# EAGLE design adc12-st (EAGLE 7.2.0)
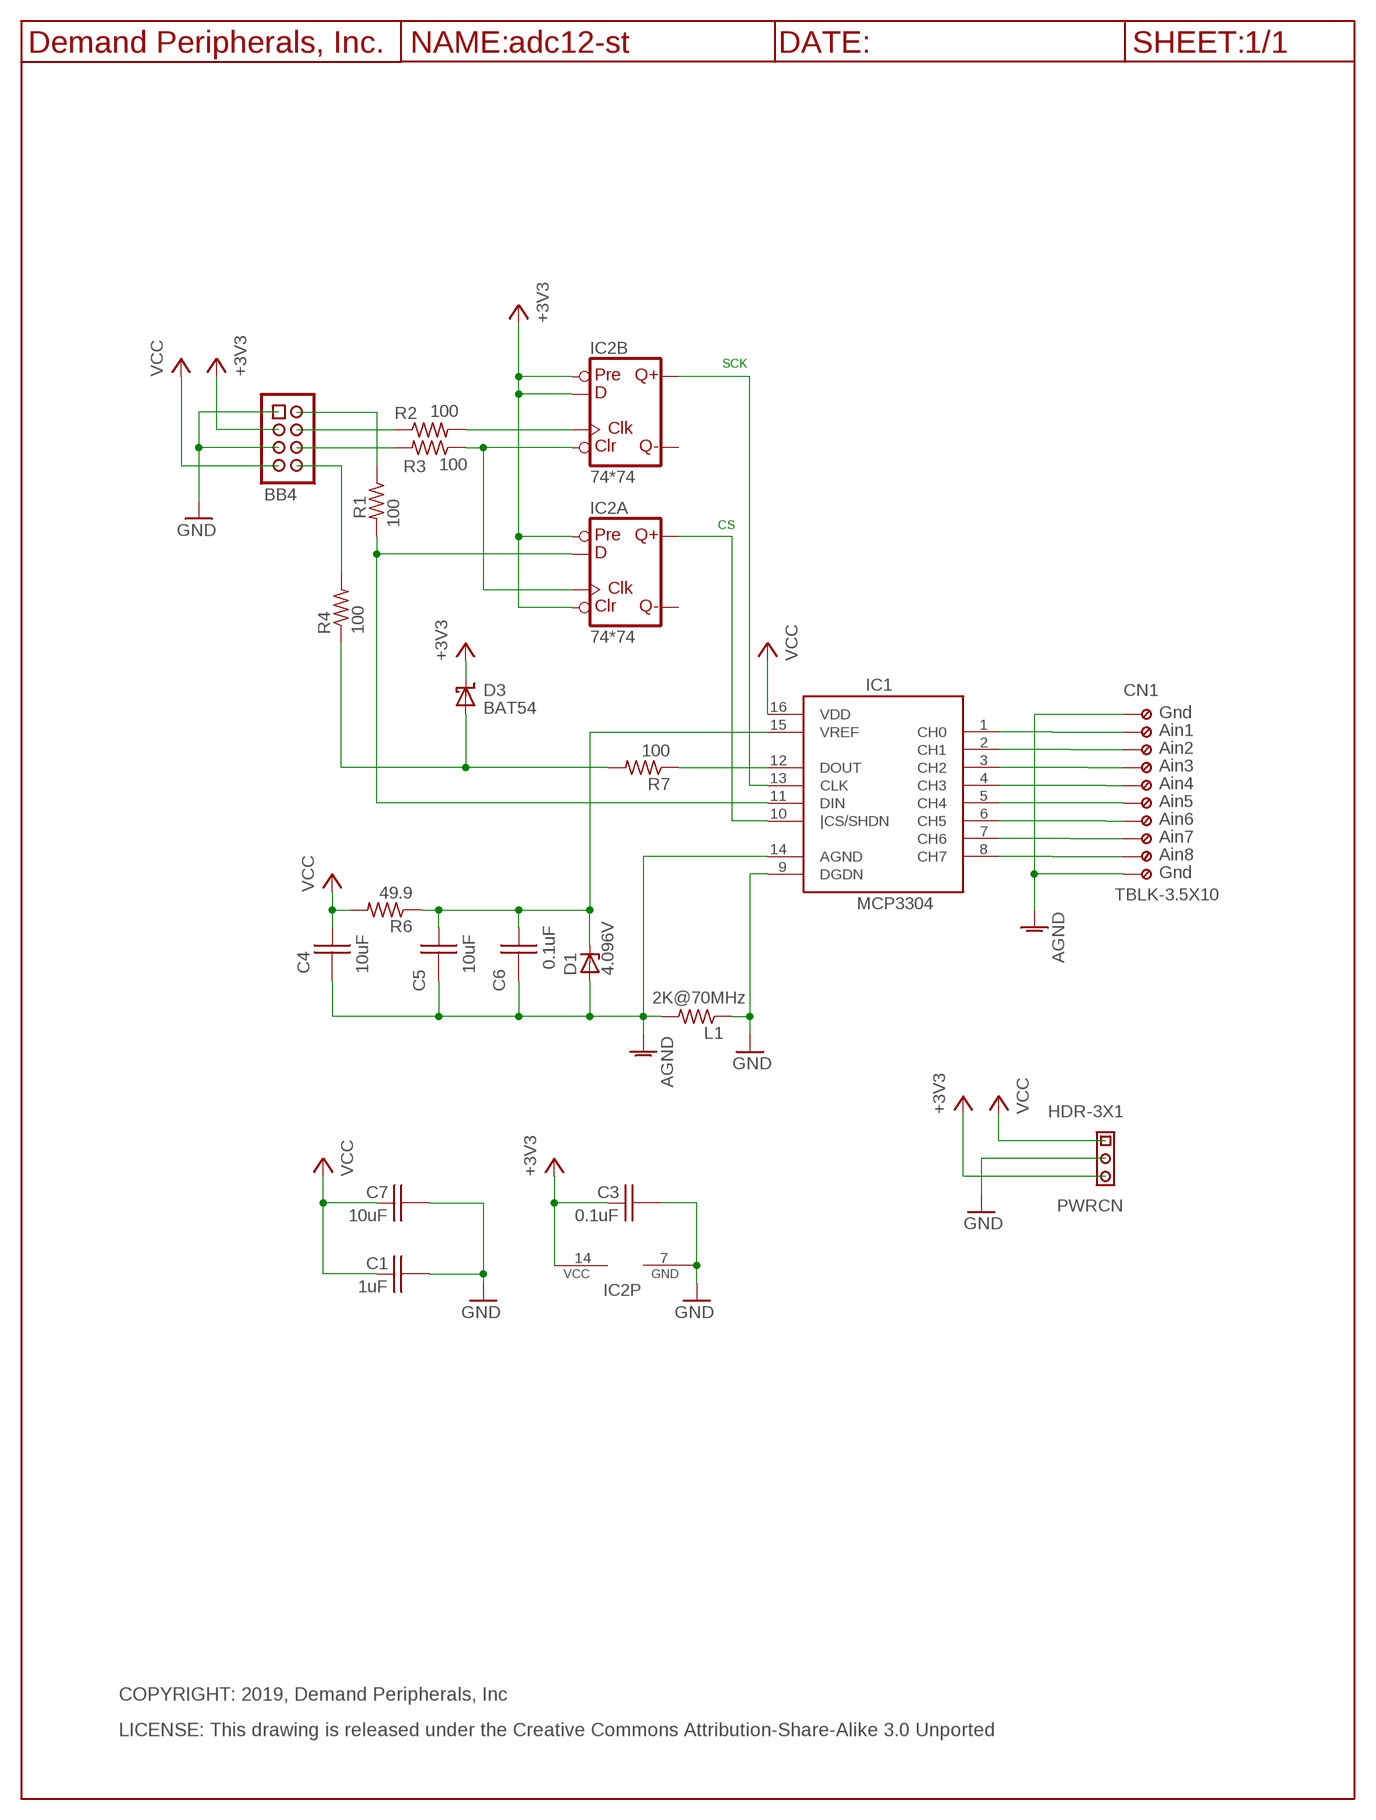
[diagram p0: schematic, sheet 1]

## Parts
BB4  BB4_CON  HDR-4X2-SHR  [HDR-4X2]
C1  1uF  C1.0UF_C0603  [C0603]
C3  0.1uF  C0.1UF_C0603  [C0603]
C4  10uF  C10UF35V_C0805  [C0805]
C5  10uF  C10UF35V_C0805  [C0805]
C6  0.1uF  C0.1UF_C0603  [C0603]
C7  10uF  C10UF35V_C0805  [C0805]
CN1  TBLK-3.5X10  [TBLK-3.5X10]
D1  4.096V  LM4040  [SOT23]
D3  BAT54  [SOT23]
IC1  MCP3304  [SO16]
IC2  74*74  74AHC74SS  [SO14]
L1  2K@70MHz  L2K70MHZR0805  [R0805]
PWRCN  HDR-3X1  [HDR-3X1]
R1  100  R100_R0603  [R0603]
R2  100  R100_R0603  [R0603]
R3  100  R100_R0603  [R0603]
R4  100  R100_R0603  [R0603]
R6  49.9  R49.9R0603  [R0603]
R7  100  R100_R0603  [R0603]
U$3  DP_FRAME_P  [LETTER_P]

## Nets
+3V3: BB4.3 C3.1 D3.3(CC) IC2.1(A:CLR) IC2.4(A:PRE) IC2.10(B:PRE) IC2.12(B:D) IC2.14(P:VCC) PWRCN.3
AGND: C4.2 C5.2 C6.2 CN1.1(KL) CN1.10(KL9) D1.2(A) IC1.14(AGND) L1.2
GND: BB4.1 BB4.5 C1.2 C3.2 C7.2 IC1.9(DGDN) IC2.7(P:GND) L1.1 PWRCN.2
N$1: CN1.2(KL1) IC1.1(CH0)
N$2: CN1.3(KL2) IC1.2(CH1)
N$3: CN1.4(KL3) IC1.3(CH2)
N$4: CN1.5(KL4) IC1.4(CH3)
N$5: CN1.6(KL5) IC1.5(CH4)
N$6: CN1.7(KL6) IC1.6(CH5)
N$7: CN1.8(KL7) IC1.7(CH6)
N$8: CN1.9(KL8) IC1.8(CH7)
N$9: IC1.12(DOUT) R7.1
N$11: D3.1(A) R4.1 R7.2
N$13: IC2.3(A:CLK) IC2.13(B:CLR) R3.1
N$14: BB4.4 R2.1
N$15: IC1.11(DIN) IC2.2(A:D) R1.2
N$16: IC2.11(B:CLK) R2.2
N$17: IC1.10(|CS/SHDN) IC2.5(A:Q)
N$18: IC1.13(CLK) IC2.9(B:Q)
N$19: BB4.6 R3.2
N$20: BB4.2 R1.1
N$21: BB4.8 R4.2
N$23: C5.1 C6.1 D1.1(C) IC1.15(VREF) R6.1
VCC: BB4.7 C1.1 C4.1 C7.1 IC1.16(VDD) PWRCN.1 R6.2
Unconnected: IC2.6(A:!Q) IC2.8(B:!Q)

## Notes on the sheet
- SCK
- CS
- Gnd
- Ain1
- Ain2
- Ain3
- Ain4
- Ain5
- Ain6
- Ain7
- Ain8
- Gnd
- COPYRIGHT: 2019, Demand Peripherals, Inc
- LICENSE: This drawing is released under the Creative Commons Attribution-Share-Alike 3.0 Unported

## Library data of the parts
BB4 = dpi-conn:HDR-4X2-SHR: Shrouded 4x2 pin header; VENDOR: Digikey; VENDOR-PART-NUM: 609-3530-ND
C1 = dpi-passive:C1.0UF_: 1.0 uF Capacitor, 25V, Y5V; VENDOR: Digikey; VENDOR-PART-NUM: 490-3897-2-ND
C3 C6 = dpi-passive:C0.1UF_: 0.1 uF Capacitor, 25V, X7R; VENDOR: Digikey; VENDOR-PART-NUM: 1276-1126-2-ND
C4 C5 C7 = dpi-passive:C10UF35V_: 10 uF Capacitor, 35V, X6S; VENDOR: Digikey; VENDOR-PART-NUM: 490-10504-2-ND
CN1 = dpi-conn:TBLK-3.5X10: Terminal Block, 3.5mm, x10, screw terminals; VENDOR: Digikey; VENDOR-PART-NUM: ED2735-ND
D1 = dpi-diopto:LM4040: Zener Diode, 4.096 volts, +/-0.2%; VENDOR: Digikey; VENDOR-PART-NUM: LM4040BIM3-4.1/NOPBCT-ND
D3 = dpi-diopto:BAT54: Schottky Diode; VENDOR: Digikey; VENDOR-PART-NUM: DB3Y313KELCT-ND
IC1 = dpi-transic:MCP3304: 8 channel ADC converter with SPI interface; VENDOR: Digikey; VENDOR-PART-NUM: MCP3304-CI/SL-ND
IC2 = dpi-transic:74AHC74: Dual D type positive edge triggered FLIP FLOP, preset and clear; VENDOR: Digikey; VENDOR-PART-NUM: 568-4458-1-ND
L1 = dpi-passive:L2K70MHZ: Ferrite filter, 2K Ohm at 70MHz; VENDOR: Digikey; VENDOR-PART-NUM: 1276-6330-1-ND
PWRCN = dpi-conn:HDR-3X1: 3 pin header on 0.1 inch centers, no shroud, no lock; VENDOR: Digikey; VENDOR-PART-NUM: 952-2264-ND
R1-R4 R7 = dpi-passive:R100_: 100 Ohm resistor, 1%, 0.1 watt; VENDOR: Digikey; VENDOR-PART-NUM: 311-100HRTR-ND
R6 = dpi-passive:R49.9: 49.9 Ohm resistor, 1%, 0.1 watt; VENDOR: Digikey; VENDOR-PART-NUM: 311-49.9HRTR-ND
U$3 = DP:DP_FRAME_P: Portrait/Letter Document Frame

## Board
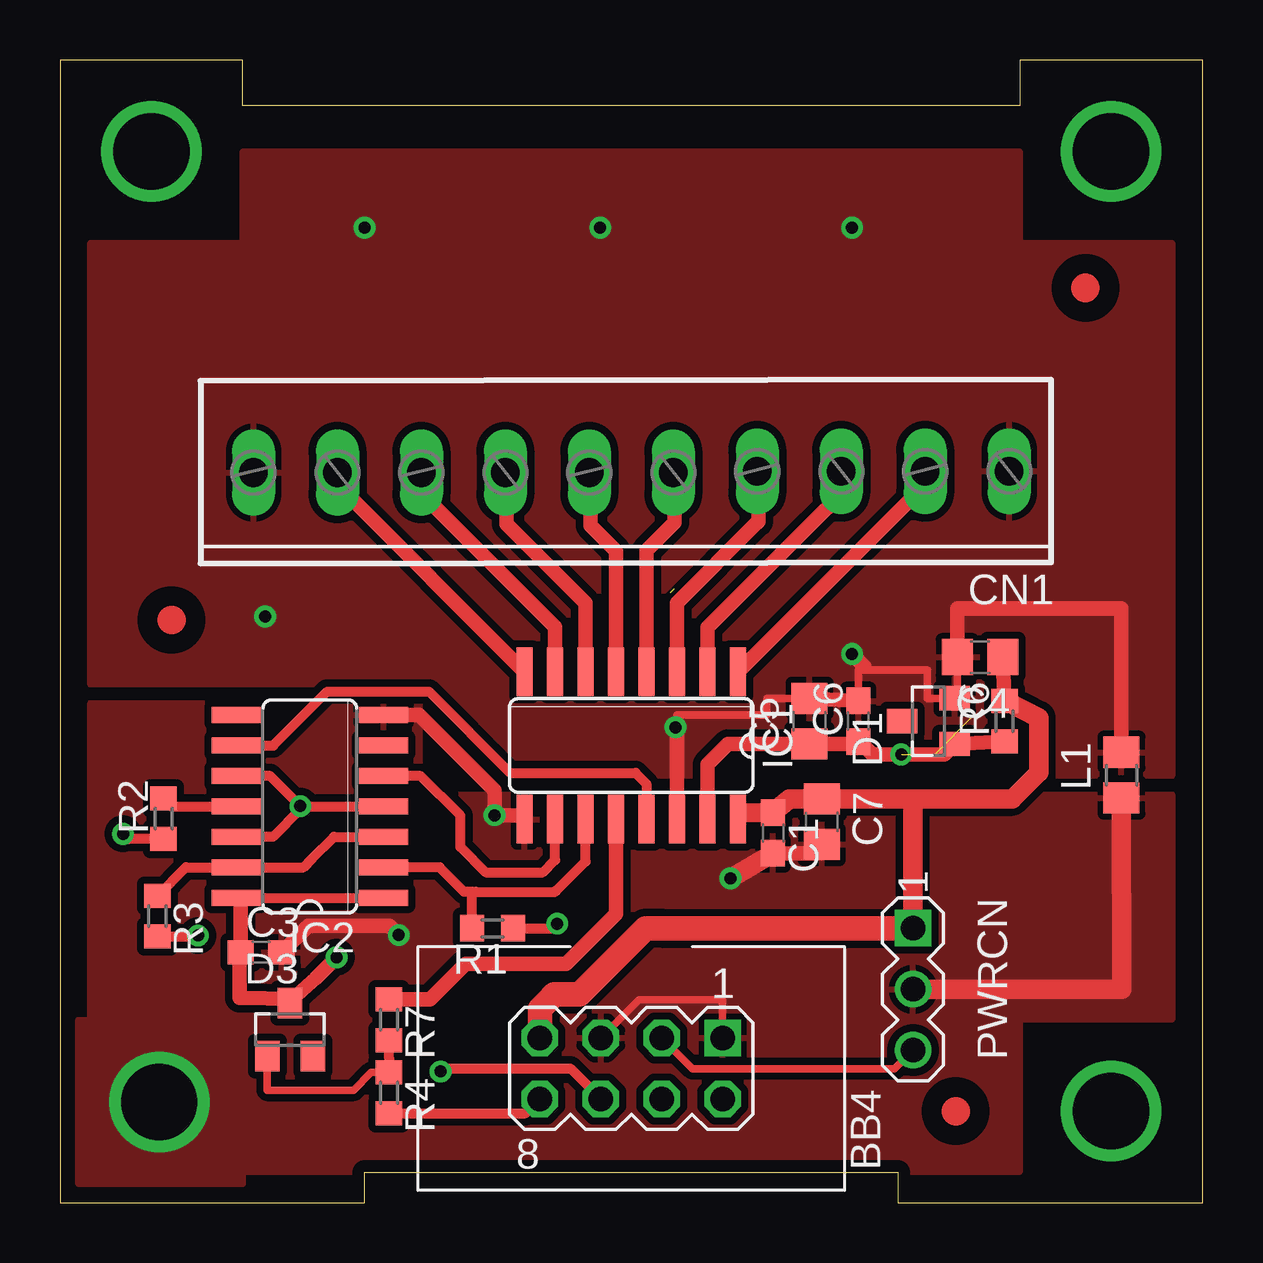
[diagram p1: board, top side]
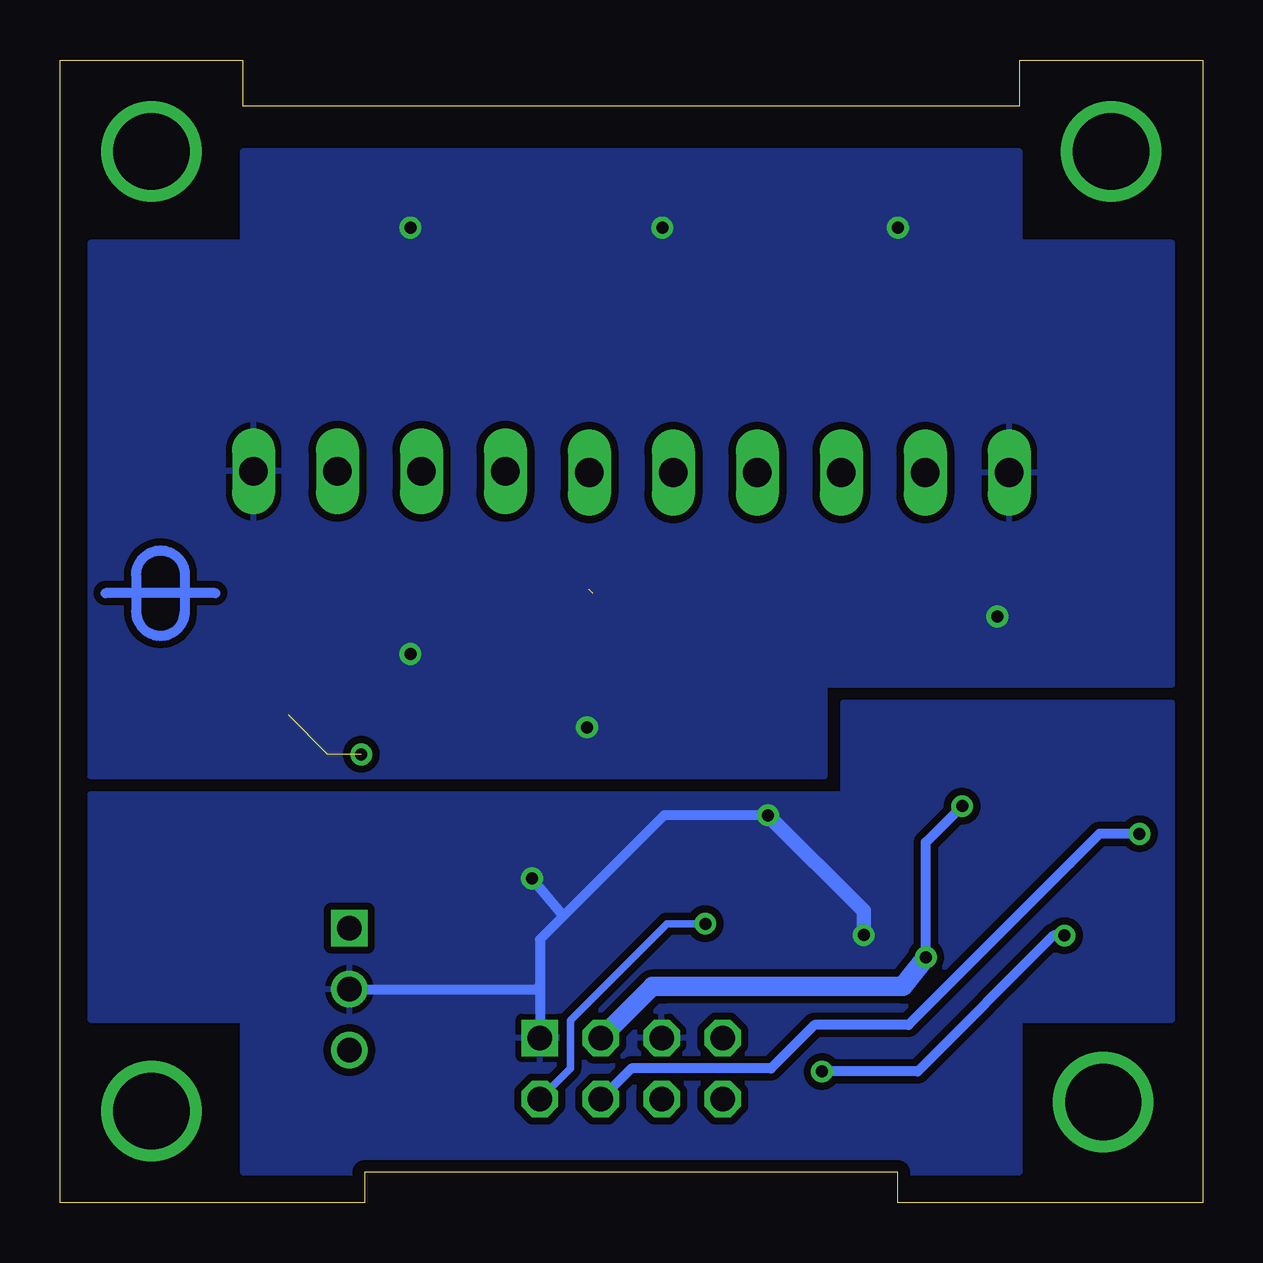
[diagram p2: board, bottom side, seen from below]

Size 47.62 x 47.62 mm. Coordinates in mm from the lower left corner, seen from the top.
Outline: 0,0 12.7,0 12.7,1.27 34.92,1.27 34.92,0 47.62,0 47.62,47.62 40.01,47.62 40.01,45.72 7.62,45.72 7.62,47.62 0,47.62 0,0
Copper layers (1*16): Top 0.035mm / dielectric 1.5mm / Bottom 0.035mm
Design rules "default *": minimum track width 10mil, minimum drill 19mil, track to track 12mil, track to pad 12mil, pad to pad 12mil, via to via 12mil, smd to smd 10mil, copper to edge 20mil, drill to drill 12mil, minimum pad ring 10mil, minimum via ring 8mil, stop-mask expansion 4mil, vias tented up to drill 0mil, thermal gap 10mil
tKeepout: area 15.1,1 to 32.5,9.7

### Footprints (pad centres in the part's own frame; a part is rotated, then mirrored left to right if it is on the bottom)
HDR-4X2 = drill 1.016 square: 1 -3.81,-1.27 | drill 1.016 octagon: 2 -3.81,1.27; 3 -1.27,-1.27; 4 -1.27,1.27; 5 1.27,-1.27; 6 1.27,1.27; 7 3.81,-1.27; 8 3.81,1.27
C0603 = smd 1.1 x 1: 1 -0.85,0; 2 0.85,0
C0805 = smd 1.3 x 1.5: 1 -0.95,0; 2 0.95,0
TBLK-3.5X10 = drill 1.2 long: 1 -15.75,0; 2 -12.25,0; 3 -8.75,0; 4 -5.25,0; 5 -1.75,0.05; 6 1.75,0.05; 7 5.25,0.05; 8 8.75,0.05; 9 12.25,0.05; 10 15.75,0.05
SOT23 = smd 1.016 x 1.27: 1 -0.95,-1.1; 2 0.95,-1.1; 3 0,1.1
SO16 = smd 0.66 x 2.032: 1 -4.445,-3.073; 2 -3.175,-3.073; 3 -1.905,-3.073; 4 -0.635,-3.073; 5 0.635,-3.073; 6 1.905,-3.073; 7 3.175,-3.073; 8 4.445,-3.073; 9 4.445,3.073; 10 3.175,3.073; 11 1.905,3.073; 12 0.635,3.073; 13 -0.635,3.073; 14 -1.905,3.073; 15 -3.175,3.073; 16 -4.445,3.073
SO14 = smd 0.66 x 2.032: 1 -3.81,-3.073; 2 -2.54,-3.073; 3 -1.27,-3.073; 4 0,-3.073; 5 1.27,-3.073; 6 2.54,-3.073; 7 3.81,-3.073; 8 3.81,3.073; 9 2.54,3.073; 10 1.27,3.073; 11 0,3.073; 12 -1.27,3.073; 13 -2.54,3.073; 14 -3.81,3.073
R0805 = smd 1.3 x 1.5: 1 -0.95,0; 2 0.95,0
HDR-3X1 = drill 1.016 square: 1 -2.54,0 | drill 1.016: 2 0,0; 3 2.54,0
R0603 = smd 1 x 1.1: 1 -0.85,0; 2 0.85,0

### Placement (x,y rotation side)
BB4  23.81,5.59 180 top
C1  29.72,15.41 270 top
C3  8.38,10.43 0 top
C4  38.35,22.73 180 top
C5  31.24,20.07 90 top
C6  33.27,20.07 90 top
C7  31.75,15.88 270 top
CN1  23.81,30.48 180 top
D1  36.2,20.07 90 top
D3  9.59,7.21 0 top
IC1  23.81,19.05 180 top
IC2  10.41,16.51 90 top
L1  44.25,17.82 90 top
PWRCN  35.56,8.89 270 top
R1  18.03,11.43 180 top
R2  4.32,16 90 top
R3  4.06,11.94 270 top
R4  13.72,4.57 270 top
R6  39.37,20.07 90 top
R7  13.72,7.62 270 top
U$1  [DPI-1]  43.43,25.4 270 bottom
U$2  [FIDUCIAL]  42.75,38.13 0 top
U$3  -2.54,-2.54 0 top
U$5  [FIDUCIAL]  37.34,3.81 0 top
U$6  [FIDUCIAL]  4.65,24.28 0 top

### Tracks (layer width: path | path; a pad name or v marks a point on that pad's centre or on a via)
+3V3  (via drill 0.5)
  Top 0.305: PWRCN.3 34.78,5.58 27.33,5.58 26.36,5.58 BB4.3
  Top 0.406: IC2.10 8.76,17.78 v10.02,16.52 | IC2.4 10.03,16.51 v10.02,16.52 | IC2.12 8.88,15.24 10.02,16.38 v10.02,16.52 | IC2.14 7.68,12.7 IC2.1
  Top 0.61: 7.68,12.7 7.53,12.55 C3.1 7.53,10.31 7.79,10.31 7.49,10.1 7.49,8.52 9.7,8.5 | v11.53,10.22 10.67,9.36 9.7,8.5 | 9.7,8.5 D3.3
  Bottom 0.406: v11.53,10.22 11.53,15.01 v10.02,16.52
  Bottom 0.813: v11.53,10.22 12.5,9 22.43,9 22.94,9 BB4.3
AGND  (via drill 0.5)
  Top 0.305: C5.2 29.46,21.02 29.46,20.32 25.72,20.32 25.72,19.63 | C4.2 37.4,21.02 D1.2 36.16,21.02 36.16,22.2 33.27,22.2 C6.2
  Top 0.61: C5.2 C6.2 | IC1.14 25.72,19.63 | 33.53,22.35 v33.02,22.86 | L1.2 44.25,24.75 38.33,24.75 37.4,24.75 C4.2
  other vias: 25.65,19.81 12.7,40.64 8.55,24.42 22.52,40.64 33.02,40.64
  pour Top: 46.35,40.01 46.35,17.78 15.75,17.78 15.75,21.59 1.27,21.59 1.27,40.01 7.62,40.01 7.62,43.81 40.01,43.81 40.01,40.01
  pour Bottom: 46.35,40.01 46.35,17.78 15.75,17.78 15.75,21.59 1.27,21.59 1.27,40.01 7.62,40.01 7.62,43.81 40.01,43.81 40.01,40.01
GND  (via drill 0.5, 3.17 pad 3.17)
  Top 0.305: BB4.5 24.13,8.45 24.4,8.45 27.62,8.45 BB4.1
  Top 0.61: C7.2 31.7,14.54 C1.2 | IC1.9 19.2,16.14 v18.11,16.14 18.11,17.17 14.96,20.32 IC2.7 | C3.2 10.34,11.53 13.74,11.53 v14.12,11.15
  Top 0.813: PWRCN.2 44.26,8.89 L1.1 | v27.95,13.51 C1.2
  Bottom 0.406: 26.64,11.94 27.62,10.96 27.62,9.09 | 27.62,9.09 BB4.1 | 26.64,11.94 v27.95,13.51 | v18.11,16.14 22.44,16.14 26.64,11.94 | PWRCN.2 27.62,8.89 27.62,9.09
  Bottom 0.61: v18.11,16.14 14.12,12.15 v14.12,11.15
  other vias: 4.14,4.19
  pour Bottom: 1.27,20.83 14.99,20.83 14.99,17.02 46.35,17.02 46.35,7.62 40.01,7.62 40.01,1.27 7.62,1.27 7.62,7.62 1.27,7.62
  pour Top: 1.27,20.83 14.99,20.83 14.99,17.02 46.35,17.02 46.35,7.62 40.01,7.62 40.01,1.27 7.62,1.27 7.62,0.76 0.76,0.76 0.76,7.62 1.27,7.62
N$1
  Top 0.61: IC1.1 36.06,29.93 36.11,29.98 CN1.2
N$2
  Top 0.61: IC1.2 26.99,23.96 31.3,28.28 32.56,29.54 32.61,29.59 CN1.3
N$3
  Top 0.61: IC1.3 25.72,24.99 29.02,28.3 29.06,28.34 29.11,28.39 CN1.4
N$4
  Top 0.61: IC1.4 24.45,27.18 25.43,28.16 25.56,28.29 25.61,28.34 CN1.5
N$5
  Top 0.61: IC1.5 23.18,27.15 22.11,28.22 CN1.6
N$6
  Top 0.61: IC1.6 21.91,24.99 18.61,28.29 CN1.7
N$7
  Top 0.61: IC1.7 20.64,23.99 15.1,29.53 15.06,29.57 15.11,29.61 CN1.8
N$8
  Top 0.61: IC1.8 11.56,29.93 11.61,29.98 CN1.9
N$9
  Top 0.61: IC1.12 23.18,12.04 21.09,9.96 16.92,9.96 15.43,8.47 R7.1
N$10  (via drill 3.17)
  other vias: 3.81,43.81
N$11
  Top 0.305: D3.1 8.64,4.69 12.24,4.69 12.98,5.42 R4.1
  Top 0.406: R4.1 13.72,6.06 R7.2
N$12  (via drill 3.17)
  other vias: 43.81,43.81
N$13
  Top 0.406: IC2.3 11.42,15.24 10.49,14.31 10.15,13.97 IC2.13 5.25,13.97 R3.1
N$14  (via drill 0.5)
  Top 0.406: v2.63,15.37 2.84,15.15 R2.1
  Bottom 0.406: v2.63,15.37 4.29,15.37 5.52,14.13 12.26,7.4 16.17,7.4 17.98,5.59 23.81,5.59 BB4.4
N$15
  Top 0.406: IC1.11 21.91,14.21 20.74,13.04 20.65,12.95 17.34,12.95 17.18,12.95 | 17.18,12.95 16.84,12.95 16.13,13.66 15.82,13.97 IC2.2 | R1.2 17.18,12.95
N$16
  Top 0.406: IC2.11 4.66,16.51 R2.2
N$17
  Top 0.406: IC1.10 20.64,14.28 20.13,13.77 17.74,13.77 16.69,14.82 16.69,16.13 15.04,17.78 IC2.5
N$18
  Top 0.406: IC1.13 24.45,17.45 23.99,17.91 18.77,17.91 15.38,21.3 11.14,21.3 8.89,19.05 IC2.9
N$19  (via drill 0.5)
  Top 0.406: R3.2 5.72,11.09 v5.75,11.12 | v15.86,5.46 15.99,5.59 20.75,5.59 21.27,5.59 BB4.6
  Bottom 0.406: v15.86,5.46 11.87,5.46 6.21,11.12 v5.75,11.12
N$20  (via drill 0.5)
  Top 0.406: v20.73,11.62 20.54,11.43 R1.1
  Bottom 0.305: v20.73,11.62 22.33,11.62 26.35,7.59 26.35,5.59 BB4.2
N$21
  Top 0.406: R4.2 19.41,3.72 BB4.8
N$23  (via drill 0.5)  (2 unrouted)
  Top 0.61: R6.1 D1.1 36.86,18.68 v35.06,18.68 33.87,18.68 33.34,19.22 C6.1 33.17,19.12 C5.1 27.84,19.12 26.99,18.26 IC1.15
N$46  (via drill 3.17 pad 3.17)
  other vias: 43.81,3.81
S$4  (1 unrouted)
VCC
  Top 0.406: 28.47,16.24 arc-8 IC1.16
  Top 0.61: R6.2 C4.1
  Top 0.813: R6.2 39.42,20.92 40.79,20.21 40.79,17.92 39.7,16.82 35.56,16.82 | 28.47,16.24 C1.1 30.41,16.83 C7.1 33.31,16.82 35.56,16.82 | PWRCN.1 35.56,16.82
  Top 1.016: PWRCN.1 25.08,11.43 24.41,11.43 21.65,8.67 20.6,8.67 20.32,8.39 20,8.08 BB4.7

### Text on the board
tTest: 1.875 Inches | 1.575 Inches | ADC812-ST, Rev 19A | 8 | 7 | 6 | 5 | 4 | 3 | 2 | 1 | Gnd | Gnd | C4 | IC2 | C5 | D1 | R6 | IC1 | R2 | C6 | L1 | C7 | 1.575 Inches | 1.875 Inches | R1 | C1 | R3 | 5 | C3 | R7 | G | 3 | (C) 2019, Demand Peripherals, Inc. | D2 | R4 | BB4